# EAGLE design menlo_cnc_de10 (EAGLE 9.0.0)
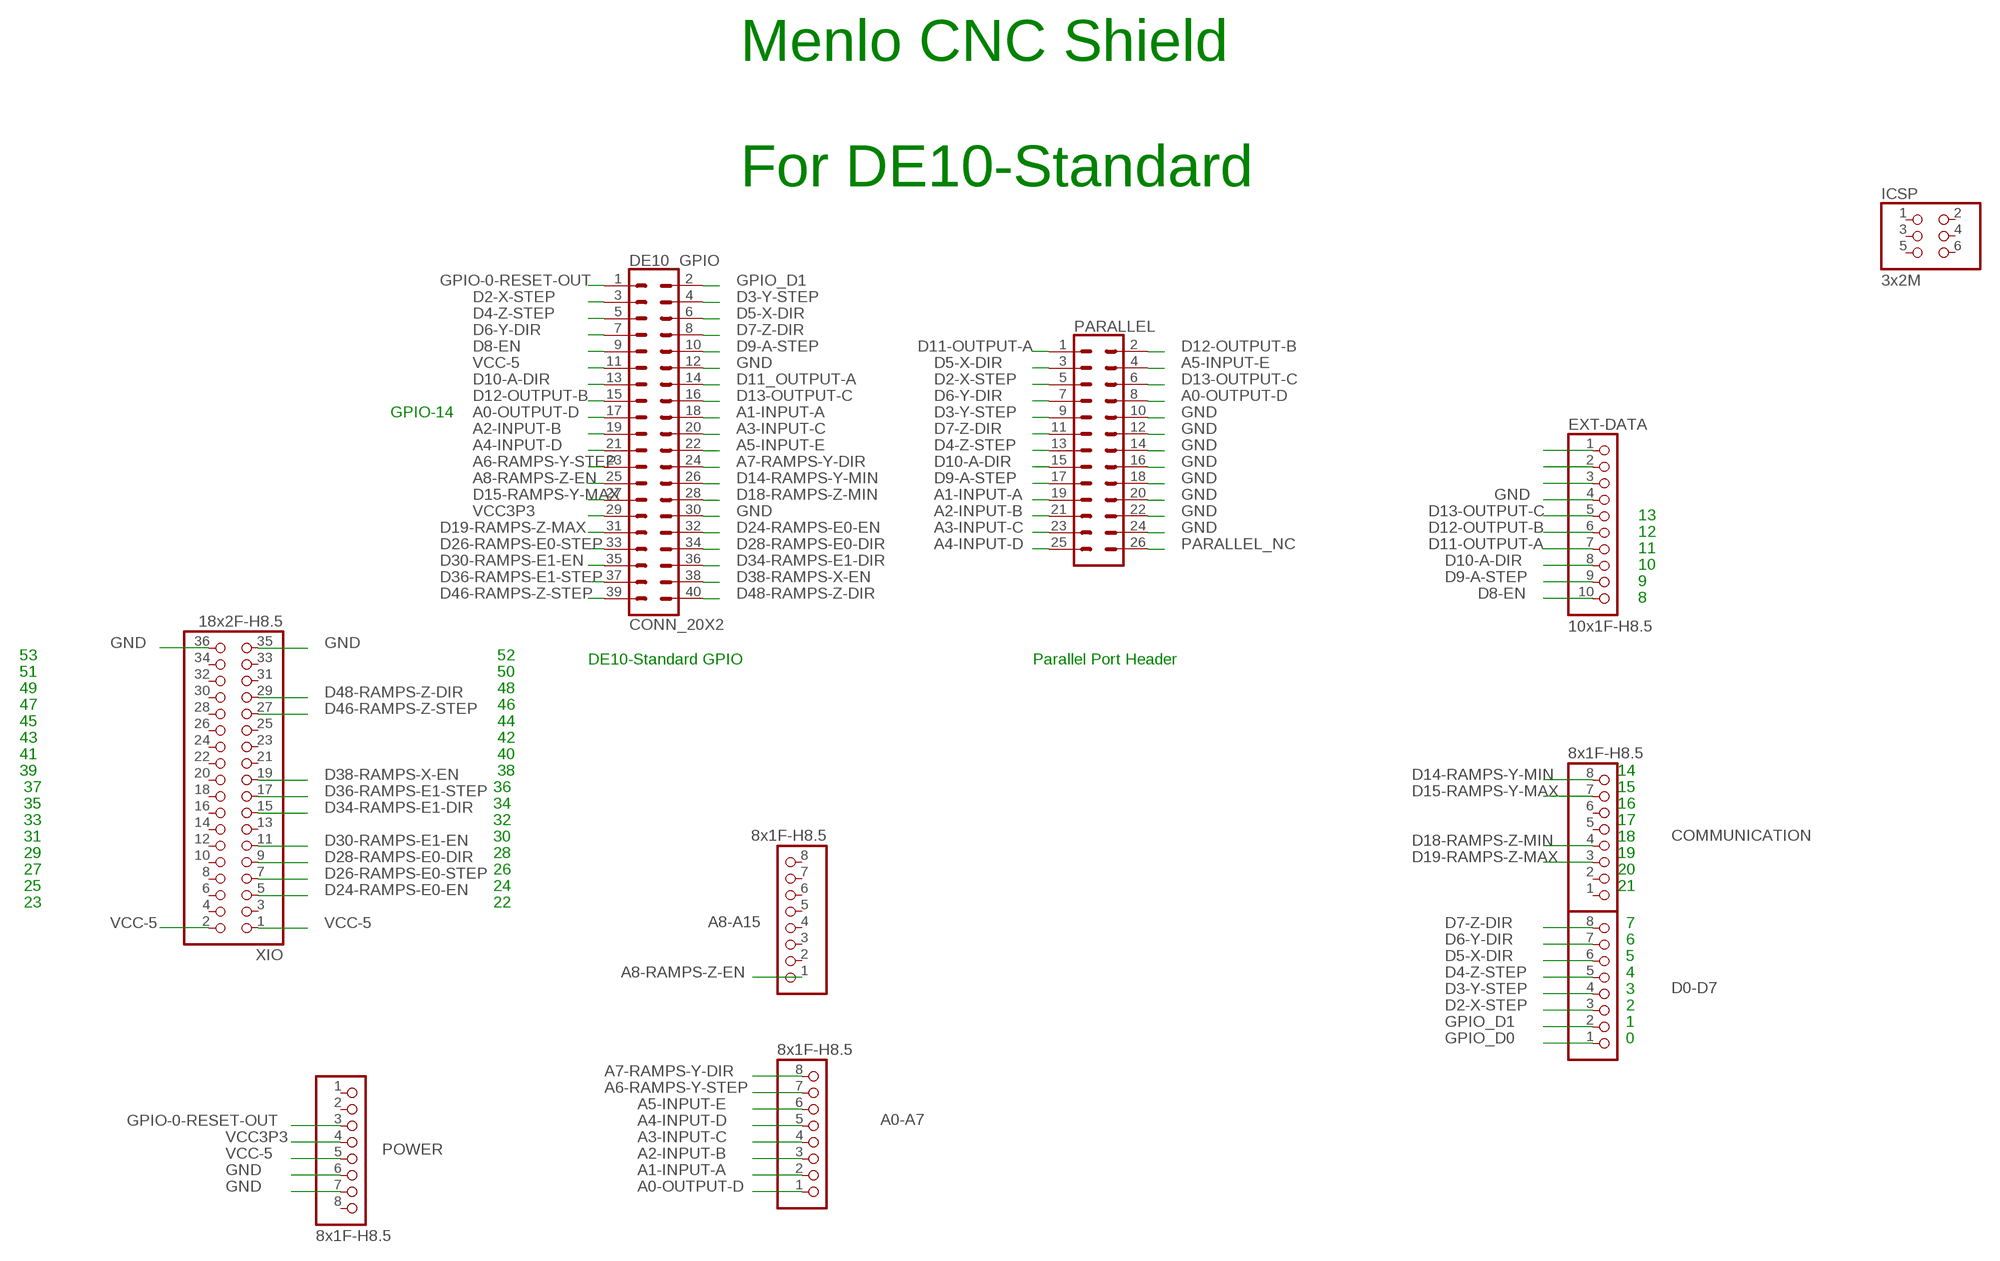
[diagram p0: schematic, sheet 1]

## Parts
A0-A7  8x1F-H8.5  PINHD-1X8  [1X08]
A8-A15  8x1F-H8.5  PINHD-1X8  [1X08]
COMMUNICATION  8x1F-H8.5  PINHD-1X8  [1X08]
D0-D7  8x1F-H8.5  PINHD-1X8  [1X08]
DE10_GPIO  CONN_20X2  [2X20]
EXT-DATA  10x1F-H8.5  PINHD-1X10_ARD  [1X10]
ICSP  3x2M  PINHD-2X3  [2X03]
PARALLEL  CONN_13X22X13  [2X13]
POWER  8x1F-H8.5  PINHD-1X8  [1X08]
XIO  18x2F-H8.5  PINHD-2X18  [2X18]

## Nets
A0-OUTPUT-D: A0-A7.1 DE10_GPIO.17 PARALLEL.8
A1-INPUT-A: A0-A7.2 DE10_GPIO.18 PARALLEL.19
A2-INPUT-B: A0-A7.3 DE10_GPIO.19 PARALLEL.21
A3-INPUT-C: A0-A7.4 DE10_GPIO.20 PARALLEL.23
A4-INPUT-D: A0-A7.5 DE10_GPIO.21 PARALLEL.25
A5-INPUT-E: A0-A7.6 DE10_GPIO.22 PARALLEL.4
A6-RAMPS-Y-STEP: A0-A7.7 DE10_GPIO.23
A7-RAMPS-Y-DIR: A0-A7.8 DE10_GPIO.24
A8-RAMPS-Z-EN: A8-A15.1 DE10_GPIO.25
D2-X-STEP: D0-D7.3 DE10_GPIO.3 PARALLEL.5
D3-Y-STEP: D0-D7.4 DE10_GPIO.4 PARALLEL.9
D4-Z-STEP: D0-D7.5 DE10_GPIO.5 PARALLEL.13
D5-X-DIR: D0-D7.6 DE10_GPIO.6 PARALLEL.3
D6-Y-DIR: D0-D7.7 DE10_GPIO.7 PARALLEL.7
D7-Z-DIR: D0-D7.8 DE10_GPIO.8 PARALLEL.11
D8-EN: DE10_GPIO.9 EXT-DATA.10
D9-A-STEP: DE10_GPIO.10 EXT-DATA.9 PARALLEL.17
D10-A-DIR: DE10_GPIO.13 EXT-DATA.8 PARALLEL.15
D11-OUTPUT-A: EXT-DATA.7 PARALLEL.1
D11_OUTPUT-A: DE10_GPIO.14
D12-OUTPUT-B: DE10_GPIO.15 EXT-DATA.6 PARALLEL.2
D13-OUTPUT-C: DE10_GPIO.16 EXT-DATA.5 PARALLEL.6
D14-RAMPS-Y-MIN: COMMUNICATION.8 DE10_GPIO.26
D15-RAMPS-Y-MAX: COMMUNICATION.7 DE10_GPIO.27
D18-RAMPS-Z-MIN: COMMUNICATION.4 DE10_GPIO.28
D19-RAMPS-Z-MAX: COMMUNICATION.3 DE10_GPIO.31
D24-RAMPS-E0-EN: DE10_GPIO.32 XIO.5
D26-RAMPS-E0-STEP: DE10_GPIO.33 XIO.7
D28-RAMPS-E0-DIR: DE10_GPIO.34 XIO.9
D30-RAMPS-E1-EN: DE10_GPIO.35 XIO.11
D34-RAMPS-E1-DIR: DE10_GPIO.36 XIO.15
D36-RAMPS-E1-STEP: DE10_GPIO.37 XIO.17
D38-RAMPS-X-EN: DE10_GPIO.38 XIO.19
D46-RAMPS-Z-STEP: DE10_GPIO.39 XIO.27
D48-RAMPS-Z-DIR: DE10_GPIO.40 XIO.29
GND: DE10_GPIO.12 DE10_GPIO.30 EXT-DATA.4 PARALLEL.10 PARALLEL.12 PARALLEL.14 PARALLEL.16 PARALLEL.18 PARALLEL.20 PARALLEL.22 PARALLEL.24 POWER.6 POWER.7 XIO.35 XIO.36
GPIO-0-RESET-OUT: DE10_GPIO.1 POWER.3
GPIO_D0: D0-D7.1
GPIO_D1: D0-D7.2 DE10_GPIO.2
N$8: EXT-DATA.3
N$9: EXT-DATA.2
N$10: EXT-DATA.1
PARALLEL_NC: PARALLEL.26
VCC3P3: DE10_GPIO.29 POWER.4
VCC-5: DE10_GPIO.11 POWER.5 XIO.1 XIO.2
Unconnected: A8-A15.2 A8-A15.3 A8-A15.4 A8-A15.5 A8-A15.6 A8-A15.7 A8-A15.8 COMMUNICATION.1 COMMUNICATION.2 COMMUNICATION.5 COMMUNICATION.6 ICSP.1 ICSP.2 ICSP.3 ICSP.4 ICSP.5 ICSP.6 POWER.1 POWER.2 POWER.8 XIO.3 XIO.4 XIO.6 XIO.8 XIO.10 XIO.12 XIO.13 XIO.14 XIO.16 XIO.18 XIO.20 XIO.21 XIO.22 XIO.23 XIO.24 XIO.25 XIO.26 XIO.28 XIO.30 XIO.31 XIO.32 XIO.33 XIO.34

## Notes on the sheet
- Menlo CNC Shield
  
  For DE10-Standard
- GPIO-14
- 13
- 12
- 11
- 10
- 9
- 8
- 53 | 52 | DE10-Standard GPIO | Parallel Port Header
- 51 | 50
- 49 | 48
- 47 | 46
- 45 | 44
- 43 | 42
- 41 | 40
- 39 | 38 | 14
- 37 | 36 | 15
- 35 | 34 | 16
- 33 | 32 | 17
- 31 | 30 | 18
- 29 | 28 | 19
- 27 | 26 | 20
- 25 | 24 | 21
- 23 | 22
- 7
- 6
- 5
- 4
- 3
- 2
- 1
- 0

## Library data of the parts
A0-A7 A8-A15 COMMUNICATION D0-D7 POWER = SmartPrj:PINHD-1X8: PIN HEADER
DE10_GPIO = SparkFun-Connectors:CONN_20X2: Multi connection point. Often used as Generic Header-pin footprint for 0.1 inch spaced/style header connections On any of the 0.1 inch spaced packages, you can populate with these: Break Away Headers - Straight <https://www.sparkfun.com/products/116> (PRT-00116) Break Away Male Headers - Right Angle <https://www.sparkfun.com/products/553> (PRT-00553) Female Headers <https://www.sparkfun.com/products/115> (PRT-00115) Break Away Headers - Machine Pin <https://www.sparkfun.com/products/117> (PRT-00117) Break Away Female Headers - Swiss Machine Pin <https://www.sparkfun.com/products/743> (PRT-00743)
EXT-DATA = SmartPrj:PINHD-1X10_ARD: PIN HEADER
ICSP = SmartPrj:PINHD-2X3: PIN HEADER
PARALLEL = SparkFun-Connectors:CONN_13X2: Multi connection point. Often used as Generic Header-pin footprint for 0.1 inch spaced/style header connections On any of the 0.1 inch spaced packages, you can populate with these: Break Away Headers - Straight <https://www.sparkfun.com/products/116> (PRT-00116) Break Away Male Headers - Right Angle <https://www.sparkfun.com/products/553> (PRT-00553) Female Headers <https://www.sparkfun.com/products/115> (PRT-00115) Break Away Headers - Machine Pin <https://www.sparkfun.com/products/117> (PRT-00117) Break Away Female Headers - Swiss Machine Pin <https://www.sparkfun.com/products/743> (PRT-00743)
XIO = SmartPrj:PINHD-2X18: PIN HEADER

## Net classes
0 default: width 0.203 mm, drill 0.406 mm, clearance 0.203 mm
1 power: width 0.61 mm, drill 0.406 mm, clearance 0.203 mm
2 gnd: width 0.305 mm, drill 0.406 mm, clearance 0.203 mm
3 power usb: width 0.508 mm, drill 0.406 mm, clearance 0.203 mm

## Board
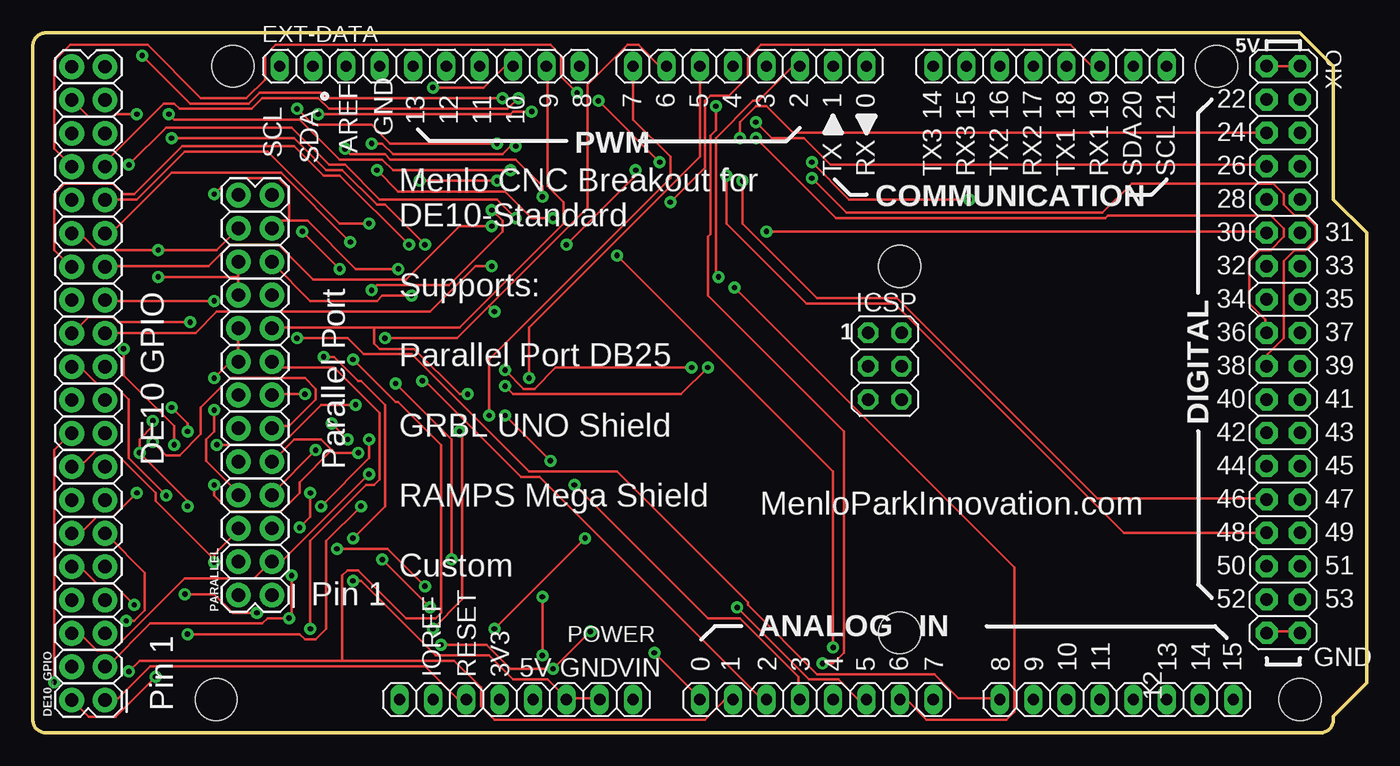
[diagram p1: board, top side]
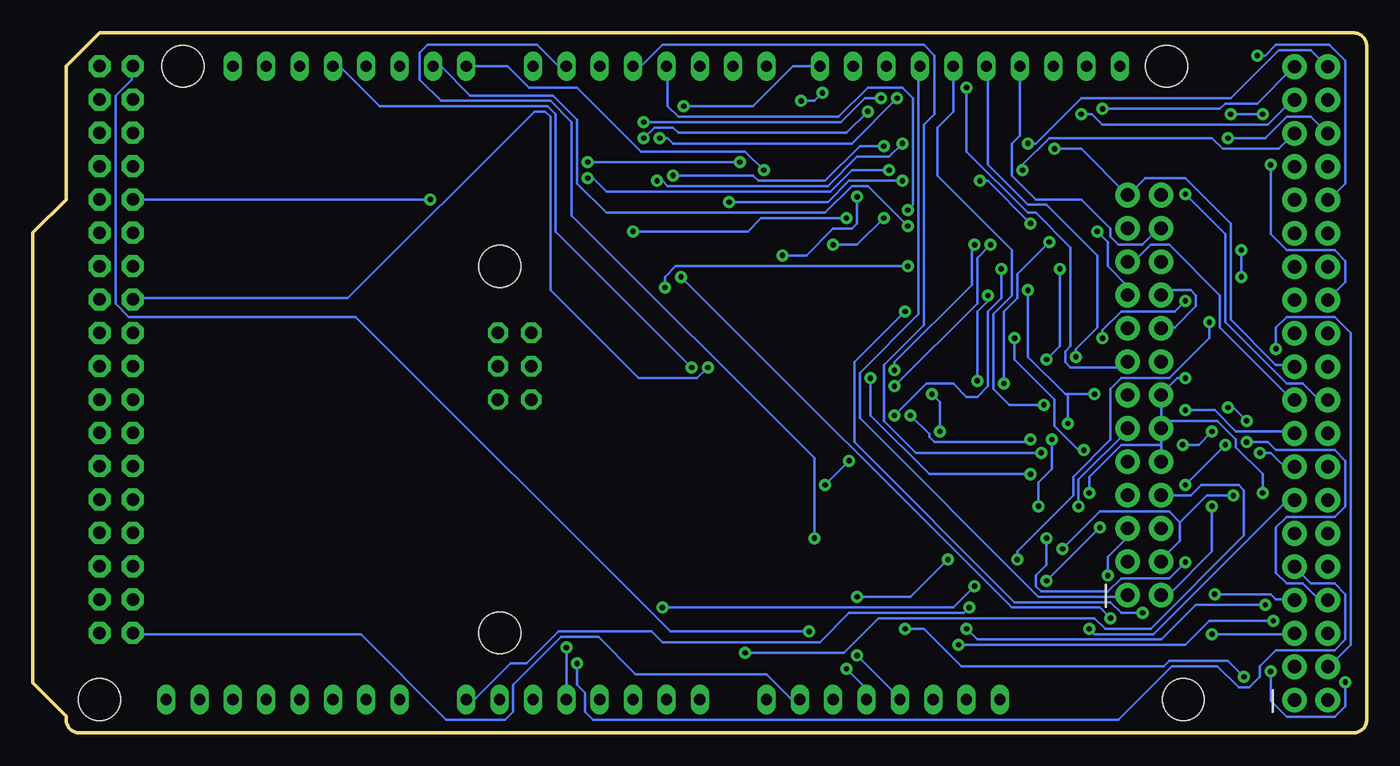
[diagram p2: board, bottom side, seen from below]

Size 101.6 x 53.34 mm. Coordinates in mm from the lower left corner, seen from the top.
Outline: 96.52,53.34 99.06,50.8 99.06,40.64 101.6,38.1 101.6,3.81 99.06,1.27 99.06,1 arc-90 98.06,0 1,0 arc-90 0,1 0,52.34 arc-90 1,53.34 96.52,53.34
Copper layers (1*16): Top 0.035mm / dielectric 1.5mm / Bottom 0.035mm
Design rules "default": minimum track width 8mil, minimum drill 16mil, track to track 7mil, track to pad 7mil, pad to pad 8mil, via to via 10mil, smd to smd 7mil, copper to edge 27mil, drill to drill 12mil, minimum pad ring 10mil, minimum via ring 10mil, stop-mask expansion 2mil, vias tented up to drill 24mil, thermal gap 10mil
Holes 3.2 mm at 96.52,2.54 15.24,50.8 90.17,50.8 13.97,2.54 66.04,35.56 66.04,7.62

### Footprints (pad centres in the part's own frame; a part is rotated, then mirrored left to right if it is on the bottom)
1X08 = drill 0.85 pad 1.422 long: 1 -8.89,0; 2 -6.35,0; 3 -3.81,0; 4 -1.27,0; 5 1.27,0; 6 3.81,0; 7 6.35,0; 8 8.89,0
2X20 = drill 1.016 pad 1.88: 1 0,0; 2 0,2.54; 3 2.54,0; 4 2.54,2.54; 5 5.08,0; 6 5.08,2.54; 7 7.62,0; 8 7.62,2.54; 9 10.16,0; 10 10.16,2.54; 11 12.7,0; 12 12.7,2.54; 13 15.24,0; 14 15.24,2.54; 15 17.78,0; 16 17.78,2.54; 17 20.32,0; 18 20.32,2.54; 19 22.86,0; 20 22.86,2.54; 21 25.4,0; 22 25.4,2.54; 23 27.94,0; 24 27.94,2.54; 25 30.48,0; 26 30.48,2.54; 27 33.02,0; 28 33.02,2.54; 29 35.56,0; 30 35.56,2.54; 31 38.1,0; 32 38.1,2.54; 33 40.64,0; 34 40.64,2.54; 35 43.18,0; 36 43.18,2.54; 37 45.72,0; 38 45.72,2.54; 39 48.26,0; 40 48.26,2.54
1X10 = drill 0.85 pad 1.422 long: 1 -11.43,0; 2 -8.89,0; 3 -6.35,0; 4 -3.81,0; 5 -1.27,0; 6 1.27,0; 7 3.81,0; 8 6.35,0; 9 8.89,0; 10 11.43,0
2X03 = drill 0.95 pad 1.55 octagon: 1 -2.54,-1.27; 2 -2.54,1.27; 3 0,-1.27; 4 0,1.27; 5 2.54,-1.27; 6 2.54,1.27
2X13 = drill 1.016 pad 1.88: 1 0,0; 2 0,2.54; 3 2.54,0; 4 2.54,2.54; 5 5.08,0; 6 5.08,2.54; 7 7.62,0; 8 7.62,2.54; 9 10.16,0; 10 10.16,2.54; 11 12.7,0; 12 12.7,2.54; 13 15.24,0; 14 15.24,2.54; 15 17.78,0; 16 17.78,2.54; 17 20.32,0; 18 20.32,2.54; 19 22.86,0; 20 22.86,2.54; 21 25.4,0; 22 25.4,2.54; 23 27.94,0; 24 27.94,2.54; 25 30.48,0; 26 30.48,2.54
2X18 = drill 0.95 pad 1.676 octagon: 1 -21.59,-1.27; 2 -21.59,1.27; 3 -19.05,-1.27; 4 -19.05,1.27; 5 -16.51,-1.27; 6 -16.51,1.27; 7 -13.97,-1.27; 8 -13.97,1.27; 9 -11.43,-1.27; 10 -11.43,1.27; 11 -8.89,-1.27; 12 -8.89,1.27; 13 -6.35,-1.27; 14 -6.35,1.27; 15 -3.81,-1.27; 16 -3.81,1.27; 17 -1.27,-1.27; 18 -1.27,1.27; 19 1.27,-1.27; 20 1.27,1.27; 21 3.81,-1.27; 22 3.81,1.27; 23 6.35,-1.27; 24 6.35,1.27; 25 8.89,-1.27; 26 8.89,1.27; 27 11.43,-1.27; 28 11.43,1.27; 29 13.97,-1.27; 30 13.97,1.27; 31 16.51,-1.27; 32 16.51,1.27; 33 19.05,-1.27; 34 19.05,1.27; 35 21.59,-1.27; 36 21.59,1.27

### Placement (x,y rotation side)
A0-A7  59.69,2.54 0 top
A8-A15  82.55,2.54 0 top
COMMUNICATION  77.47,50.8 180 top
D0-D7  54.61,50.8 180 top
DE10_GPIO  5.5,2.5 90 top
EXT-DATA  30.23,50.8 0 top
ICSP  64.9,27.94 270 top
PARALLEL  18.2,10.5 90 top
POWER  36.83,2.54 0 top
XIO  95.25,29.21 270 top

### Tracks (layer width: path | path; a pad name or v marks a point on that pad's centre or on a via)
A0-OUTPUT-D  (via drill 0.41)
  Top 0.203: v47.35,6.1 50.8,2.64 A0-A7.1 | v13.82,24.59 13.82,22.96 13.21,22.35 13.21,20.73 15.65,18.29 PARALLEL.8
  Bottom 0.203: v47.35,6.1 39.83,6.1 37.19,8.74 20.73,8.74 19.91,7.92 16.46,7.92 9.35,15.04 9.35,18.49 9.75,18.9 12.6,18.9 13.41,18.09 15.65,18.09 PARALLEL.8 | v13.82,24.59 11.58,24.59 9.96,22.96 5.69,22.96 DE10_GPIO.17
A1-INPUT-A  (via drill 0.41)
  Top 0.203: 23.57,5.49 8.13,5.49 v7.32,4.67 | 23.57,5.49 32.11,5.49 34.14,3.45 34.14,2.03 35.15,1.02 51.21,1.02 52.63,2.44 53.24,2.44 A0-A7.2 | v1.63,3.86 1.63,21.54 2.85,22.76 DE10_GPIO.18 | v23.37,35.36 v20.52,38.2 | v24.38,28.45 27.64,25.2 27.84,25.2 31.09,21.95 31.09,9.14 30.68,8.74 28.45,8.74 24.79,12.39 23.98,12.39 23.57,11.99 23.57,5.49
  Bottom 0.203: v7.32,4.67 7.32,2.44 6.1,1.22 2.44,1.22 1.63,2.03 v1.63,3.86 | v20.52,38.2 19.71,37.39 19.71,35.56 18.29,34.14 18.29,33.53 PARALLEL.19 | v23.37,35.36 23.37,29.46 v24.38,28.45
A2-INPUT-B  (via drill 0.41)
  Top 0.203: v29.67,26.82 29.87,26.82 37.19,19.51 38.61,19.51 55.47,2.64 55.88,2.64 A0-A7.3 | v28.85,33.33 26.62,33.33 26.21,32.92 21.13,32.92 18.29,35.76 PARALLEL.21
  Bottom 0.203: v29.67,26.82 29.67,32.11 28.85,32.92 v28.85,33.33 | DE10_GPIO.19 5.69,25.4 11.18,30.89 11.18,33.33 15.04,37.19 16.46,37.19 17.68,35.97 18.09,35.97 PARALLEL.21
A3-INPUT-C  (via drill 0.41)
  Top 0.203: v41.25,18.9 51.41,8.74 53.85,8.74 58.32,4.27 58.32,2.64 A0-A7.4 | v35.97,24.18 v39.42,20.73 | v27.84,35.36 24.59,35.36 20.93,39.01 19.51,39.01 | 19.51,39.01 18.69,39.01 18.29,38.61 PARALLEL.23 | v13.82,41.05 15.04,42.27 18.69,42.27 19.51,41.45 19.51,39.01
  Bottom 0.203: v39.42,20.73 v41.25,18.9 | v35.97,24.18 33.53,26.62 31.5,26.62 30.48,25.6 29.67,25.6 28.85,26.42 28.85,32.11 27.84,33.12 v27.84,35.36 | v13.82,41.05 10.77,38 10.77,31.29 6.1,26.62 4.88,26.62 3.66,25.4 3.05,25.4 DE10_GPIO.20
A4-INPUT-D  (via drill 0.41)
  Top 0.203: v60.96,6.5 60.96,19.91 v44.5,36.37 | v38.81,40.84 38.81,41.66 36.78,43.69 27.23,43.69 26.82,44.09 24.18,44.09 v23.77,44.5
  Bottom 0.203: v60.96,6.5 A0-A7.5 | v44.5,36.37 42.67,36.37 40.64,38.41 39.22,38.41 38.81,38.81 v38.81,40.84 | v23.77,44.5 21.74,44.5 18.29,41.05 PARALLEL.25 18.09,41.05 16.87,42.27 13.82,42.27 10.36,38.81 10.36,31.5 6.91,28.04 5.69,28.04 DE10_GPIO.21
A5-INPUT-E  (via drill 0.41)
  Top 0.203: v53.65,9.55 59.13,4.06 61.37,4.06 62.79,2.64 63.4,2.64 A0-A7.6 | v29.87,11.18 27.03,14.02 v23.16,14.02 | v10.16,18.09 7.32,20.93 7.32,25.4 6.1,26.62 4.88,26.62 3.66,27.84 3.05,27.84 DE10_GPIO.22
  Bottom 0.203: v53.65,9.55 31.5,9.55 v29.87,11.18 | v23.16,14.02 20.32,16.87 15.04,16.87 14.22,16.05 | 14.22,16.05 14.22,14.63 15.65,13.21 PARALLEL.4 | v10.16,18.09 12.19,18.09 14.22,16.05
A6-RAMPS-Y-STEP  (via drill 0.41)
  Top 0.203: v53.44,33.93 74.78,12.6 74.78,1.63 74.17,1.02 68.07,1.02 66.65,2.44 66.04,2.44 A0-A7.7 | v34.95,35.56 33.73,35.56 30.28,32.11 14.02,32.11 12.39,30.48 5.69,30.48 DE10_GPIO.23
  Bottom 0.203: v53.44,33.93 53.44,34.75 52.63,35.56 v34.95,35.56
A7-RAMPS-Y-DIR  (via drill 0.41)
  Top 0.203: v26.62,13.21 v30.28,9.55 | v11.99,31.29 6.5,31.29 6.1,31.7 4.27,31.7 3.05,30.48 DE10_GPIO.24
  Bottom 0.203: v30.28,9.55 30.68,9.14 39.42,9.14 41.66,6.91 53.65,6.91 54.46,7.72 61.57,7.72 64.01,5.28 65.23,5.28 67.87,2.64 68.48,2.64 A0-A7.8 | v26.62,13.21 26.62,13.82 22.35,18.09 22.35,19.51 19.51,22.35 19.51,26.21 18.69,27.03 15.04,27.03 11.99,30.07 v11.99,31.29
A8-RAMPS-Z-EN  (via drill 0.41)
  Top 0.203: v20.12,30.07 23.98,30.07 25.2,28.85 28.85,28.85 37.8,19.91 44.5,19.91 54.46,9.96 54.46,9.75 59.74,4.47 68.68,4.47 70.51,2.64 73.56,2.64 A8-A15.1 | v13.82,32.92 5.69,32.92 DE10_GPIO.25
  Bottom 0.203: v20.12,30.07 20.12,30.68 18.69,32.11 14.63,32.11 v13.82,32.92
D2-X-STEP  (via drill 0.41)
  Top 0.203: D0-D7.3 57.91,50.8 55.27,48.16 54.86,48.16 52.02,45.31 52.02,34.95 v52.22,34.75 | DE10_GPIO.3 5.69,5.08 8.94,8.33 17.48,8.33 17.88,8.74 v19.51,8.74 19.71,8.94 v19.71,11.99
  Bottom 0.203: v52.22,34.75 27.03,9.55 20.32,9.55 v19.51,8.74 | v19.71,11.99 19.71,13.41 18.29,14.83 18.29,15.44 PARALLEL.5
D3-Y-STEP  (via drill 0.41)
  Top 0.203: v24.79,21.34 22.96,21.34 22.76,21.54 | 22.76,21.54 21.95,22.35 19.91,22.35 18.29,20.73 PARALLEL.9 | v6.91,29.26 6.91,27.23 10.77,23.37 v10.77,21.95 | v13.82,18.9 13.82,18.09 15.04,16.87 18.9,16.87 20.32,18.29 20.32,19.1 22.76,21.54
  Bottom 0.203: D0-D7.4 55.27,50.8 53.65,52.43 33.73,52.43 32.92,51.61 32.92,47.14 33.73,46.33 33.73,31.09 36.78,28.04 36.78,23.77 34.34,21.34 v24.79,21.34 | v6.91,29.26 6.91,30.89 6.1,31.7 2.44,31.7 1.22,30.48 1.22,6.71 2.85,5.08 DE10_GPIO.4 | v13.82,18.9 v10.77,21.95
D4-Z-STEP  (via drill 0.41)
  Top 0.203: v34.95,39.83 35.76,39.01 35.76,38.2 31.7,34.14 26.21,34.14 v25.81,33.73 | v20.73,25.81 18.29,25.81 PARALLEL.13 | v11.79,7.52 20.32,7.52 20.73,7.11 21.54,7.11 22.35,7.92 22.35,14.63 v24.99,17.27 | v22.76,23.57 v23.98,22.35
  Bottom 0.203: v34.95,39.83 34.54,40.23 34.54,48.36 35.36,49.17 38,49.17 40.23,46.94 52.43,46.94 53.24,47.75 53.24,50.8 D0-D7.5 | v25.81,33.73 25.81,28.65 22.96,25.81 22.76,25.81 | v20.73,25.81 22.76,25.81 | v11.79,7.52 5.69,7.52 DE10_GPIO.5 | v24.99,17.27 24.99,19.1 23.98,20.12 v23.98,22.35 | 22.76,25.81 v22.76,23.57
D5-X-DIR  (via drill 0.41)
  Top 0.203: D0-D7.6 50.8,43.89 37.8,30.89 v37.8,27.03 | v25.6,19.71 19.1,13.21 18.29,13.21 PARALLEL.3 18.09,13.01 16.87,11.79 11.58,11.79 6.1,6.3 4.88,6.3 3.66,7.52 3.05,7.52 DE10_GPIO.6
  Bottom 0.203: v37.8,27.03 37.8,24.18 33.33,19.71 v25.6,19.71
D6-Y-DIR  (via drill 0.41)
  Top 0.203: D0-D7.7 47.75,50.8 46.13,52.43 45.31,52.43 42.27,49.38 42.27,40.03 34.75,32.51 | 34.75,32.51 32.31,30.07 v26.82,30.07 | v21.54,21.54 18.29,18.29 PARALLEL.7 | v11.58,10.57 13.82,10.57 15.24,9.14 v17.07,9.14 | 34.75,32.51 v35.15,32.11
  Bottom 0.203: v26.82,30.07 26.82,28.45 23.77,25.4 23.77,23.37 21.95,21.54 v21.54,21.54 | v11.58,10.57 7.32,10.57 6.91,10.16 5.69,10.16 DE10_GPIO.7 | v17.07,9.14 18.69,9.14 19.51,9.96 26.82,9.96 39.01,22.15 39.01,28.25 v35.15,32.11
D7-Z-DIR  (via drill 0.41)
  Top 0.203: D0-D7.8 45.72,46.74 48.56,43.89 48.56,42.27 34.75,28.45 v34.75,24.18 | v25.6,22.35 25.6,20.93 v21.95,17.27 | v9.14,22.15 10.16,21.13 11.18,21.13 12.8,22.76 12.8,24.79 15.04,27.03 20.73,27.03 21.54,26.21 21.54,25.4 19.51,23.37 18.29,23.37 PARALLEL.11
  Bottom 0.203: v34.75,24.18 33.33,22.76 33.33,22.55 32.92,22.15 25.81,22.15 v25.6,22.35 | v21.95,17.27 21.95,19.3 18.09,23.16 PARALLEL.11 | v9.14,22.15 7.52,22.15 6.91,21.54 2.44,21.54 1.63,20.73 1.63,17.27 2.44,16.46 6.1,16.46 6.91,15.65 6.91,12.19 6.1,11.38 4.88,11.38 3.66,10.16 3.05,10.16 DE10_GPIO.8
D8-EN  (via drill 0.41)
  Top 0.203: v52.02,47.75 52.02,45.92 51.61,45.52 51.61,38 51.41,37.8 51.41,33.33 61.77,22.96 61.77,6.1 60.96,5.28 v60.15,5.28
  Bottom 0.203: EXT-DATA.10 43.69,50.8 46.74,47.75 v52.02,47.75 | v60.15,5.28 60.15,3.66 59.54,3.05 59.54,1.63 58.93,1.02 18.9,1.02 14.83,5.08 11.38,5.08 9.75,3.45 8.94,3.45 8.13,4.27 8.13,5.08 6.91,6.3 2.44,6.3 1.63,7.11 1.63,10.57 2.44,11.38 4.27,11.38 5.49,12.6 DE10_GPIO.9
D9-A-STEP  (via drill 0.41)
  Top 0.203: 26.01,30.89 18.29,30.89 PARALLEL.17 | 26.01,30.89 32.51,30.89 40.44,38.81 40.44,40.44 39.22,41.66 39.22,50.8 EXT-DATA.9 | v7.72,9.75 6.1,11.38 4.88,11.38 3.66,12.6 3.05,12.6 DE10_GPIO.10 | v30.48,7.92 32.72,10.16 32.72,22.76 v32.51,22.96 | v33.12,25.81 32.51,25.81 29.06,29.26 26.42,29.26 26.01,29.67 26.01,30.89
  Bottom 0.203: v7.72,9.75 13.01,9.75 15.65,7.11 29.67,7.11 v30.48,7.92 | v32.51,22.96 32.51,25.2 v33.12,25.81
D10-A-DIR  (via drill 0.41)
  Top 0.203: EXT-DATA.8 35.97,50.8 34.34,49.17 v30.48,49.17 | v21.13,7.92 21.13,14.63 25.4,18.9 26.01,18.9 26.42,19.3 26.42,24.38 22.96,27.84 18.69,27.84 18.29,28.25 PARALLEL.15
  Bottom 0.203: v30.48,49.17 30.48,44.3 25.81,39.62 25.2,39.62 22.55,36.98 22.55,29.46 22.96,29.06 22.96,28.25 22.55,27.84 18.69,27.84 18.29,28.25 PARALLEL.15 | v21.13,7.92 20.73,7.52 16.26,7.52 6.1,17.68 5.69,17.68 DE10_GPIO.13
D11-OUTPUT-A
  Bottom 0.203: EXT-DATA.7 34.14,50.8 34.14,31.9 38.61,27.43 38.61,23.98 24.99,10.36 18.29,10.36 PARALLEL.1
D12-OUTPUT-B  (via drill 0.41)
  Top 0.203: v24.59,24.99 21.95,24.99 18.9,21.95 v14.02,21.95 | v11.79,22.96 11.79,23.57 v10.57,24.79 | v9.14,23.77 9.14,23.37 8.13,22.35 v8.13,21.34 11.79,17.68 v11.79,17.27
  Bottom 0.203: EXT-DATA.6 31.5,47.35 32.72,46.13 32.72,42.47 27.03,36.78 27.03,33.33 28.45,31.9 28.45,26.21 27.23,24.99 v24.59,24.99 | v14.02,21.95 12.8,21.95 v11.79,22.96 | v10.57,24.79 10.16,24.79 v9.14,23.77 | v8.13,21.34 7.32,21.34 6.3,20.32 5.69,20.32 DE10_GPIO.15 | v11.79,17.27 11.79,13.82 15.04,10.57 15.65,10.57 PARALLEL.2
D13-OUTPUT-C  (via drill 0.41)
  Top 0.203: v22.15,28.65 22.96,28.65 24.79,26.82 24.99,26.82 26.82,24.99 26.82,17.27 v24.38,14.83 | 13.82,13.21 13.82,13.61 15.65,15.44 PARALLEL.6 | 13.82,13.21 9.35,17.68 9.35,18.29 6.1,21.54 4.88,21.54 3.66,20.32 3.05,20.32 DE10_GPIO.16 | 13.82,13.21 v13.82,13.01
  Bottom 0.203: v22.15,28.65 22.15,29.26 20.52,30.89 20.52,36.37 24.38,40.23 25.81,40.23 28.85,43.28 28.85,50.8 EXT-DATA.5 | v24.38,14.83 24.38,12.8 25.2,11.99 25.2,11.18 24.79,10.77 19.71,10.77 18.69,11.79 15.04,11.79 v13.82,13.01
D14-RAMPS-Y-MIN  (via drill 0.41)
  Top 0.203: v45.92,42.88 45.92,42.47 v40.64,37.19 | v36.78,39.22 35.36,40.64 26.42,40.64 23.77,43.28 22.55,43.28 19.71,46.13 10.16,46.13 v7.32,43.28
  Bottom 0.203: COMMUNICATION.8 65.43,50.8 63.8,49.17 60.15,49.17 55.27,44.3 47.35,44.3 v45.92,42.88 | v40.64,37.19 38.81,37.19 v36.78,39.22 | v7.32,43.28 7.32,38 6.1,36.78 2.44,36.78 1.63,35.97 1.63,34.34 2.85,33.12 DE10_GPIO.26
D15-RAMPS-Y-MAX  (via drill 0.41)
  Top 0.203: v34.95,38.61 32.51,38.61 28.45,34.54 21.34,34.54 18.69,37.19 15.04,37.19 13.41,35.56 5.69,35.56 DE10_GPIO.27
  Bottom 0.203: COMMUNICATION.7 70.51,50.8 68.28,48.56 61.98,48.56 60.15,46.74 60.15,41.86 57.91,39.62 41.25,39.62 39.22,41.66 38,41.66 v34.95,38.61
D18-RAMPS-Z-MIN  (via drill 0.41)
  Top 0.203: v51.41,27.84 49.38,25.81 36.58,25.81 v35.97,26.42 | v28.65,37.19 23.37,42.47 22.15,42.47 19.91,44.7 11.38,44.7 7.72,41.05 6.91,41.05 6.1,41.86 2.44,41.86 1.63,41.05 1.63,36.78 2.85,35.56 DE10_GPIO.28
  Bottom 0.203: COMMUNICATION.4 78.23,50.8 75.18,47.75 62.38,47.75 61.77,47.14 61.77,38.2 v51.41,27.84 | v35.97,26.42 29.67,32.72 29.67,36.17 v28.65,37.19
D19-RAMPS-Z-MAX  (via drill 0.41)
  Top 0.203: COMMUNICATION.3 80.67,50.8 79.05,52.43 55.47,52.43 54.46,51.41 54.46,49.99 53.03,48.56 51.61,48.56 51.21,48.16 51.21,43.08 v48.56,40.44 | v29.46,42.06 v35.36,42.06 | v25.6,38.81 23.37,38.81 17.88,44.3 11.58,44.3 7.92,40.64 5.69,40.64 DE10_GPIO.31
  Bottom 0.203: v48.56,40.44 41.05,40.44 39.42,42.06 v35.36,42.06 | v29.46,42.06 28.85,42.06 v25.6,38.81
D24-RAMPS-E0-EN  (via drill 0.41)
  Top 0.203: XIO.5 57.91,45.72 55.88,47.75 55.07,47.75 53.85,46.53 v53.85,45.31 | v35.76,48.36 22.35,48.36 21.95,48.77 17.27,48.77 16.46,47.95 11.99,47.95 v8.33,51.61
  Bottom 0.203: v53.85,45.31 53.24,45.31 52.83,44.91 39.22,44.91 v35.76,48.36 | v8.33,51.61 7.72,51.61 6.91,52.43 2.85,52.43 1.63,51.21 1.63,41.86 2.85,40.64 DE10_GPIO.32
D26-RAMPS-E0-STEP  (via drill 0.41)
  Top 0.203: v55.07,46.53 56.29,45.31 58.73,45.31 60.76,43.28 93.88,43.28 XIO.7 | v36.98,48.36 36.17,47.55 22.55,47.55 21.74,48.36 17.48,48.36 16.66,47.55 11.18,47.55 10.77,47.95 9.96,47.95 5.69,43.69 5.69,43.28 DE10_GPIO.33
  Bottom 0.203: v55.07,46.53 40.03,46.53 38.2,48.36 v36.98,48.36
D28-RAMPS-E0-DIR  (via drill 0.41)
  Top 0.203: v71.32,40.64 62.18,40.64 v59.33,43.48 | v43.08,48.16 v47.75,43.48 | v41.45,48.77 40.23,49.99 40.23,51.61 39.42,52.43 18.49,52.43 17.68,51.61 17.68,49.78 16.26,48.36 12.8,48.36 8.74,52.43 2.85,52.43 1.63,51.21 1.63,44.5 2.85,43.28 DE10_GPIO.34
  Bottom 0.203: v71.32,40.64 XIO.9 | v47.75,43.48 v59.33,43.48 | v43.08,48.16 42.06,48.16 v41.45,48.77
D30-RAMPS-E1-EN  (via drill 0.41)
  Top 0.203: v55.88,38.2 93.88,38.2 XIO.11 | v39.62,39.22 38,39.22 35.97,41.25 27.84,41.25 v26.21,42.88
  Bottom 0.203: v55.88,38.2 47.14,38.2 46.13,39.22 v39.62,39.22 | v26.21,42.88 26.21,43.28 24.18,45.31 11.79,45.31 10.97,44.5 6.71,44.5 5.69,45.52 DE10_GPIO.35
D34-RAMPS-E1-DIR  (via drill 0.41)
  Top 0.203: v50.19,27.84 39.83,27.84 38.2,26.21 37.39,26.21 v35.97,27.64 | v29.87,37.19 26.82,40.23 26.21,40.23 23.57,42.88 22.35,42.88 19.91,45.31 v10.57,45.31
  Bottom 0.203: v50.19,27.84 51,27.03 55.47,27.03 62.18,33.73 62.18,46.94 62.59,47.35 63.4,47.35 77.62,33.12 93.88,33.12 XIO.15 | v35.97,27.64 35.97,28.25 30.07,34.14 30.07,36.98 v29.87,37.19 | v10.57,45.31 7.72,45.31 6.1,46.94 4.27,46.94 3.05,45.72 DE10_GPIO.36
D36-RAMPS-E1-STEP  (via drill 0.41)
  Top 0.203: v55.07,45.31 61.16,39.22 81.69,39.22 81.89,39.42 94.28,39.42 95.3,38.41 95.3,37.8 94.28,36.78 93.47,36.78 92.66,35.97 92.66,32.72 93.88,31.5 93.88,30.48 XIO.17 | v38,47.35 36.58,47.35 36.37,47.14 v21.74,47.14
  Bottom 0.203: v55.07,45.31 54.25,46.13 52.83,46.13 52.43,45.72 39.62,45.72 v38,47.35 | v21.74,47.14 20.93,47.14 20.12,46.33 7.52,46.33 5.69,48.16 DE10_GPIO.37
D38-RAMPS-X-EN  (via drill 0.41)
  Top 0.203: v59.33,42.27 61.98,39.62 81.48,39.62 83.72,41.86 94.49,41.86 95.3,41.05 95.3,40.23 96.11,39.42 96.93,39.42 97.74,38.61 97.74,37.59 96.93,36.78 96.11,36.78 95.3,35.97 95.3,30.07 94.08,28.85 94.08,28.04 XIO.19 | v36.37,42.88 27.43,42.88 26.62,43.69 23.37,43.69 20.32,46.74 10.77,46.74 v10.36,47.14 | v7.92,47.14 6.3,47.14 6.1,46.94 4.27,46.94 3.05,48.16 DE10_GPIO.38
  Bottom 0.203: v59.33,42.27 58.93,42.27 57.91,41.25 40.84,41.25 39.22,42.88 v36.37,42.88 | v7.92,47.14 v10.36,47.14
D46-RAMPS-Z-STEP  (via drill 0.41)
  Top 0.203: v54.05,42.06 54.05,38.81 59.74,33.12 65.84,33.12 81.08,17.88 93.88,17.88 XIO.27 | v35.36,44.91 27.23,44.91 25.81,46.33 21.34,46.33 v20.12,47.55
  Bottom 0.203: v54.05,42.06 53.65,42.06 53.24,41.66 41.05,41.66 38.81,43.89 36.37,43.89 v35.36,44.91 | v20.12,47.55 11.18,47.55 10.77,47.95 8.33,47.95 5.69,50.6 DE10_GPIO.39
D48-RAMPS-Z-DIR  (via drill 0.41)
  Top 0.203: XIO.29 83.11,15.24 65.63,32.72 58.93,32.72 52.83,38.81 v52.83,42.47 | v36.78,44.7 36.37,44.7 35.76,44.09 27.43,44.09 26.62,44.91 v25.81,44.91
  Bottom 0.203: v52.83,42.47 46.74,42.47 46.33,42.06 41.25,42.06 38.61,44.7 v36.78,44.7 | v25.81,44.91 25.2,44.91 21.74,48.36 10.36,48.36 6.71,52.02 4.27,52.02 3.05,50.8 DE10_GPIO.40
GND  (via drill 0.41)
  Top 0.203: PARALLEL.18 15.65,30.68 15.65,28.45 PARALLEL.16 15.65,28.25 15.04,28.25 v13.82,27.03 | 15.65,34.75 15.65,35.76 PARALLEL.22 | 15.65,34.75 15.65,33.53 PARALLEL.20 | v7.92,18.29 6.1,16.46 4.88,16.46 3.66,15.24 3.05,15.24 DE10_GPIO.12 | DE10_GPIO.30 3.05,38 3.66,38 4.88,36.78 v9.55,36.78 14.02,36.78 15.65,38.41 PARALLEL.24 | v9.55,34.75 15.65,34.75 | 40.64,2.64 43.08,2.64 POWER.7 | XIO.35 94.08,7.72 96.52,7.72 XIO.36 | v21.13,18.29 21.13,16.46 v20.32,15.65 | v24.38,11.58 24.99,11.58 30.68,5.89 34.75,5.89 36.58,4.06 39.22,4.06 40.64,2.64 | 40.64,2.64 POWER.6
  Bottom 0.203: PARALLEL.18 15.65,30.89 14.63,30.89 13.01,32.51 13.01,33.33 13.41,33.73 15.44,33.73 15.65,33.53 PARALLEL.20 | v7.92,18.29 7.92,19.71 9.96,21.74 9.96,22.35 11.38,23.77 15.24,23.77 | 15.24,23.77 15.65,23.37 PARALLEL.12 | 15.65,21.95 15.65,23.16 PARALLEL.12 | 15.65,21.95 15.65,20.73 PARALLEL.10 | 15.24,23.77 15.65,24.18 15.65,25.6 PARALLEL.14 15.65,25.81 14.43,27.03 v13.82,27.03 | 15.24,23.77 PARALLEL.12 | EXT-DATA.4 26.42,45.52 27.03,44.91 27.03,42.47 25.2,40.64 21.74,40.64 19.51,38.41 19.51,37.8 18.9,37.19 17.07,37.19 15.85,38.41 PARALLEL.24 | v9.55,36.78 v9.55,34.75 | POWER.7 43.28,2.64 43.89,2.64 45.72,4.47 55.68,4.47 58.52,7.32 61.37,7.32 65.02,3.66 65.02,1.63 65.63,1.02 70.1,1.02 76.61,7.52 93.88,7.52 XIO.35 | 15.65,21.95 18.69,21.95 21.13,19.51 v21.13,18.29 | v24.38,11.58 v20.32,15.65
GPIO-0-RESET-OUT
  Top 0.203: POWER.3 32.92,2.64 32.31,2.64 29.87,5.08 8.94,5.08 6.5,2.64 5.69,2.64 DE10_GPIO.1
GPIO_D1  (via drill 0.41)
  Top 0.203: v35.15,7.92 v42.06,14.83 | v9.35,4.27 6.3,1.22 4.27,1.22 3.05,2.44 DE10_GPIO.2
  Bottom 0.203: D0-D7.2 61.57,50.8 63.2,52.43 71.53,52.43 72.14,51.82 72.14,49.78 70.51,48.16 62.18,48.16 60.55,46.53 60.55,39.42 42.06,20.93 v42.06,14.83 | v35.15,7.92 33.73,7.92 30.89,5.08 15.44,5.08 15.04,5.49 10.57,5.49 v9.35,4.27
N$1
  pour Top: 0.64,52.7 10.79,52.7 11.18,52.7
VCC3P3  (via drill 0.41)
  Top 0.203: v38.81,10.36 v38.81,5.89 | v31.9,13.21 31.9,22.35 v27.64,26.62 | v24.18,37.39 18.9,42.67 10.57,42.67 6.1,38.2 5.69,38.2 DE10_GPIO.29
  Bottom 0.203: v38.81,5.89 35.56,2.64 POWER.4 | v38.81,10.36 34.75,10.36 v31.9,13.21 | v27.64,26.62 27.64,32.11 26.62,33.12 26.62,34.95 v24.18,37.39
VCC-5  (via drill 0.41)
  Top 0.203: XIO.2 XIO.1 | v31.09,6.71 34.54,6.71 36.37,4.88 v39.62,4.88 v42.47,7.72 | v7.11,8.53 7.72,8.53 8.53,9.35 8.53,12.19 5.69,15.04 DE10_GPIO.11
  Bottom 0.203: v39.62,4.88 38.2,3.45 38.2,2.64 POWER.5 | v31.09,6.71 13.82,6.71 11.99,8.53 v7.11,8.53 | v42.47,7.72 53.03,7.72 77.01,31.7 94.28,31.7 95.3,32.72 95.3,48.56 94.08,49.78 94.08,50.8 XIO.1

### Text on the board
tPlace: 9 | 8 | 7 | 6 | 5 | 4 | 3 | 2 | 1 | 0 | 22 | 14 | 15 | 16 | 17 | 18 | 19 | 20 | 21 | 13 | 12 | 11 | 10 | 24 | 26 | 28 | 30 | 31 | 32 | 33 | 34 | 35 | 36 | 37 | 38 | 39 | 40 | 41 | 42 | 43 | 44 | 45 | 46 | 47 | 48 | 49 | 50 | 51 | 52 | 53 | 0 | 1 | 2 | 3 | 4 | 5 | 6 | 7 | 8 | 9 | 10 | 11 | 12 | 13 | 14 | 15
tNames: 5V | GND | SCL | AREF | PWM | SDA | TX | RX | TX3 | RX3 | TX2 | RX2 | TX1 | RX1 | SDA | SCL | 1 | DIGITAL | DE10 GPIO | Parallel Port | MenloParkInnovation.com | Menlo CNC Breakout for / DE10-Standard / / Supports: / / Parallel Port DB25 / / GRBL UNO Shield / / RAMPS Mega Shield / / Custom | Pin 1 | ANALOG IN | GND | IOREF | RESET | 3V3 | 5V | GND | VIN | Pin 1